# Altium schematic sheet Ethernet.SchDoc
size A4
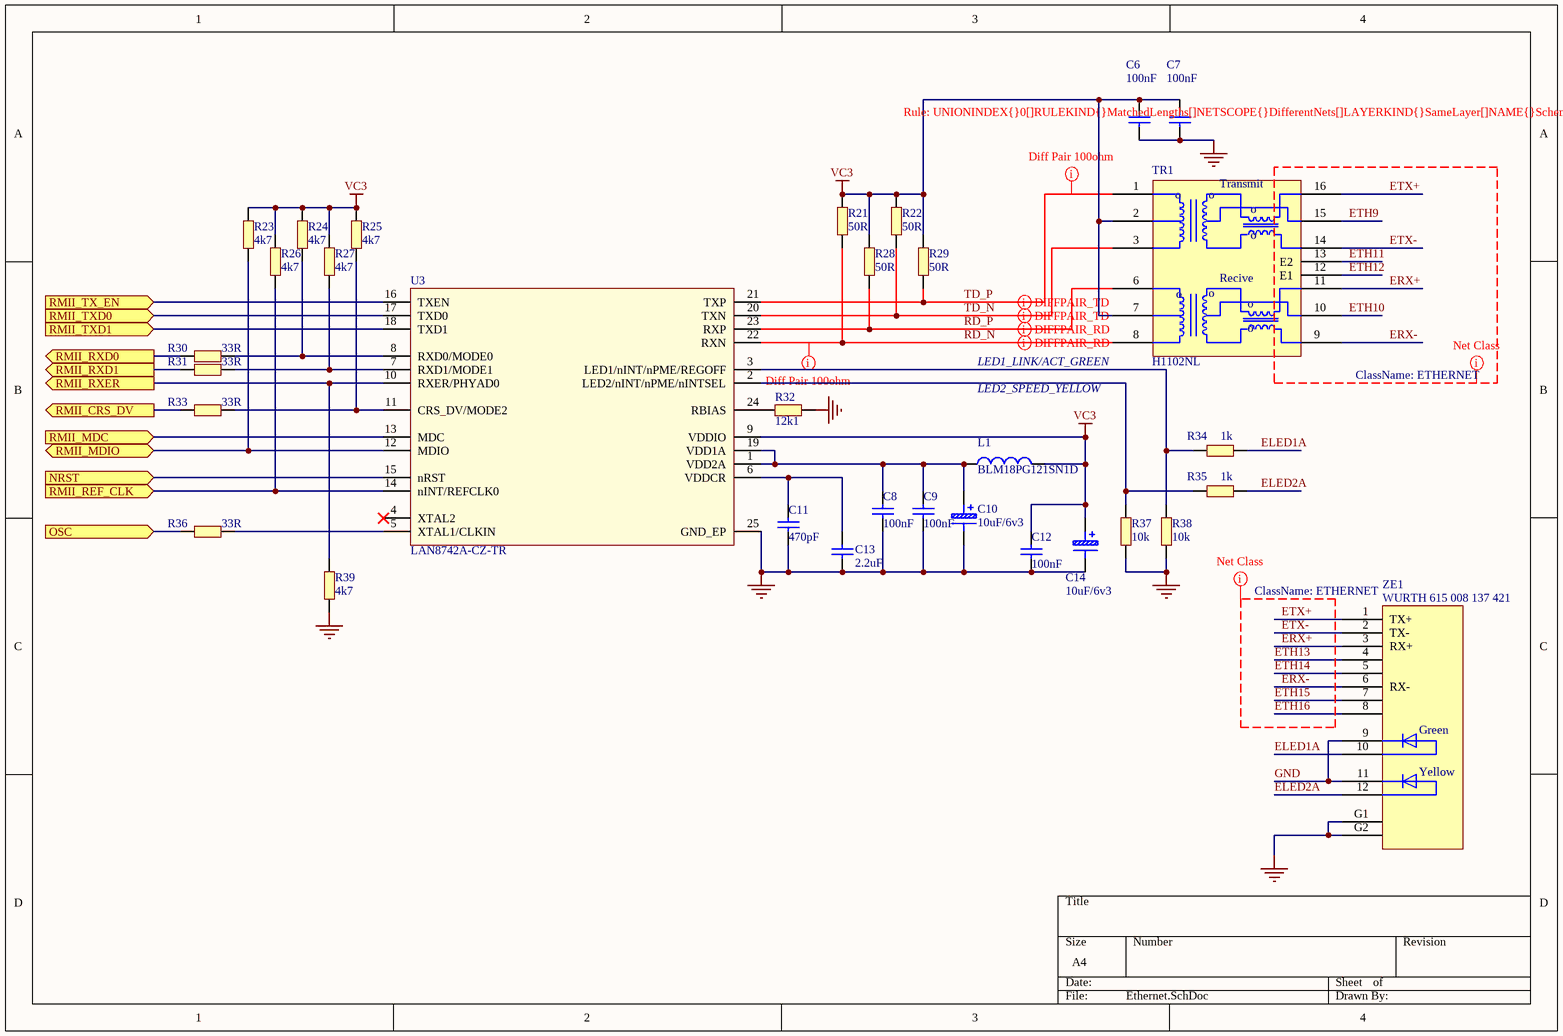
[diagram p0: Ethernet.SchDoc]

## Parts
C6  100nF  [0805C]
C7  100nF  [0805C]
C8  100nF  [0805C]
C9  100nF  [0805C]
C10  10uF/6v3  [CAP_A]
C11  470pF  [0805C]
C12  100nF  [0805C]
C13  2.2uF  [0805C]
C14  10uF/6v3  [CAP_A]
L1  BLM18PG121SN1D  [0805]
R21  50R  [0805R]
R22  50R  [0805R]
R23  4k7  [0805R]
R24  4k7  [0805R]
R25  4k7  [0805R]
R26  4k7  [0805R]
R27  4k7  [0805R]
R28  50R  [0805R]
R29  50R  [0805R]
R30  33R  [0805R]
R31  33R  [0805R]
R32  12k1  [0805R]
R33  33R  [0805R]
R34  1k  [0805R]
R35  1k  [0805R]
R36  33R  [0805R]
R37  10k  [0805R]
R38  10k  [0805R]
R39  4k7  [0805R]
TR1  H1102NL  [H1102]
U3  LAN8742A-CZ-TR  [QFN24_LAN]
ZE1  WURTH 615 008 137 421  [RJ45GELED]

## Ports
NRST (in), OSC (in), RMII_CRS_DV (out), RMII_MDC (in), RMII_MDIO (bidir), RMII_REF_CLK (in), RMII_RXD0 (out), RMII_RXD1 (out), RMII_RXER (out), RMII_TX_EN (in), RMII_TXD0 (in), RMII_TXD1 (in)

## Nets
GND: C6.1 C7.1 C8.1 C9.1 C10.1 C11.1 C12.1 C13.1 C14.1 R32.1 R37.1 R38.1 R39.1 U3.25(GND_EP) ZE1.9 ZE1.11 ZE1.G1 ZE1.G2
VC3: C6.2 C7.2 C12.2 C14.2 L1.2 R21.2 R22.2 R23.2 R24.2 R25.2 R26.2 R27.2 R28.2 R29.2 TR1.2(TI2) TR1.7(RI2) U3.9(VDDIO)
ELED1A: R34.1 ZE1.10
ELED2A: R35.1 ZE1.12
ERX+: TR1.11(RO1) ZE1.3(RX+)
ERX-: TR1.9(RO2) ZE1.6(RX-)
ETH9: TR1.15
ETH10: TR1.10
ETH11: TR1.13(E2)
ETH12: TR1.12(E1)
ETH13: ZE1.4
ETH14: ZE1.5
ETH15: ZE1.7
ETH16: ZE1.8
ETX+: TR1.16(TO1) ZE1.1(TX+)
ETX-: TR1.14(TO2) ZE1.2(TX-)
NRST: U3.15(nRST) ; port NRST
OSC: R36.1 ; port OSC
RD_N: R21.1 TR1.8(RI3) U3.22(RXN)
RD_P: R28.1 TR1.6(RI1) U3.23(RXP)
RMII_CRS_DV: R33.1 ; port RMII_CRS_DV
RMII_MDC: U3.13(MDC) ; port RMII_MDC
RMII_MDIO: R23.1 U3.12(MDIO) ; port RMII_MDIO
RMII_REF_CLK: R26.1 U3.14(nINT/REFCLK0) ; port RMII_REF_CLK
RMII_RXD0: R30.1 ; port RMII_RXD0
RMII_RXD1: R31.1 ; port RMII_RXD1
RMII_RXER: R39.2 U3.10(RXER/PHYAD0) ; port RMII_RXER
RMII_TX_EN: U3.16(TXEN) ; port RMII_TX_EN
RMII_TXD0: U3.17(TXD0) ; port RMII_TXD0
RMII_TXD1: U3.18(TXD1) ; port RMII_TXD1
TD_N: R22.1 TR1.3(TI3) U3.20(TXN)
TD_P: R29.1 TR1.1(TI1) U3.21(TXP)
NetC8_2: C8.2 C9.2 C10.2 L1.1 U3.1(VDD2A) U3.19(VDD1A)
NetC11_2: C11.2 C13.2 U3.6(VDDCR)
NetR24_1: R24.1 R30.2 U3.8(RXD0/MODE0)
NetR25_1: R25.1 R33.2 U3.11(CRS_DV/MODE2)
NetR27_1: R27.1 R31.2 U3.7(RXD1/MODE1)
NetR32_2: R32.2 U3.24(RBIAS)
NetR34_2: R34.2 R38.2 U3.3(LED1/nINT/nPME/REGOFF)
NetR35_2: R35.2 R37.2 U3.2(LED2/nINT/nPME/nINTSEL)
NetR36_2: R36.2 U3.5(XTAL1/CLKIN)

Not connected (* = marked no-connect by the designer): U3 4(XTAL2)*

## Layout directives
differential pair: RD_N, RD_P, TD_N, TD_P
rule Matched Net Lengths [Tolerance = 300mil]: RD_N, TD_P
net class ETHERNET: ERX+, ERX-, ETH9, ETH10, ETH11, ETH12, ETH13, ETH14, ETH15, ETH16, ETX+, ETX-

## Notes on the sheet
- LED1_LINK/ACT_GREEN
- LED2_SPEED_YELLOW
- (in symbol H1102NL) Transmit; o; Recive
- (in symbol RJ45GELED) Green; Yellow

## Library data of the parts
C6-C9 C12 = Cap_100nF_X7R_10%_0402: Capacitor,100nF,16V,X7R,10%,0402,YAGEO; Manuf_Part_1: CC0402KRX7R7BB104; Revision: July-2002: Re-released for DXP Platform.; Value: 100nF; Order: CC0402KRX7R7BB104; Manuf_1: YAGEO
C10 C14 = CapTantal
C11 = Cap_470pF_X7R_10%_0402: Capacitor,470pF,16V,X7R,10%,0402,YAGEO; Manuf_Part_1: 0402YC471KAT4A; Revision: July-2002: Re-released for DXP Platform.; Value: 470pF; Order: 0402YC471KAT4A; Manuf_1: YAGEO; ECCN_US/EU: n/a
C13 = Cap_1uF_X5R_10%_0603: Capacitor,1uF,16V,X5R,10%,0603,YAGEO; Manuf_Part_1: CC0603KRX5R7BB105; Revision: July-2002: Re-released for DXP Platform.; Value: 1uF; Order: CC0603KRX5R7BB105; Manuf_1: YAGEO; ECCN_US/EU: n/a
L1 = BEAD_120R_2A_0603: Bead,120R,2A,0603,BLM18PG121SN1D,MURATA; Manuf_Part_3: FCM1608KF-601T03; Manuf_2: TDK; Manuf_Part_2: MPZ1608S300A; Manuf_3: Tai-tech; Value: 100uH; Description_3: Bead,600R,350mA,0603,FCM1608KF-601T03,Tai-tech; Description_2: Bead,30R,5A,0603,MPZ1608S300A,TDK; Revision: July-2002: Re-released for DXP Platform.; ECCN_US/EU: n/a; Manuf_Part_1: BLM18PG121SN1D; Manuf_1: MURATA
R21-R39 = RES3
TR1 = H1102NL: Dostawca.Symbol: 749010310; Dostawca: WURTH
U3 = LAN8742A-CZ-TR: LAN8742A-CZ-TR - Small Footprint RMII 10/100 Ethernet, Transceiver with HP Auto-MDIX and flexPWR Technology SQFN-24; Manuf_1: MICROCHIP; Dostawca.Symbol: 579-LAN8742A-CZ; Dostawca: Mouser; Order: LAN8742A-CZ-TR; Manuf_Part_1: LAN8742A-CZ-TR; Distrib: MICROCHIP
ZE1 = RJ45GELED